# Altium schematic sheet 3_InfoPerif.SchDoc
size 414 x 293 mm; SheetNumber: 3; SheetTotal: 4
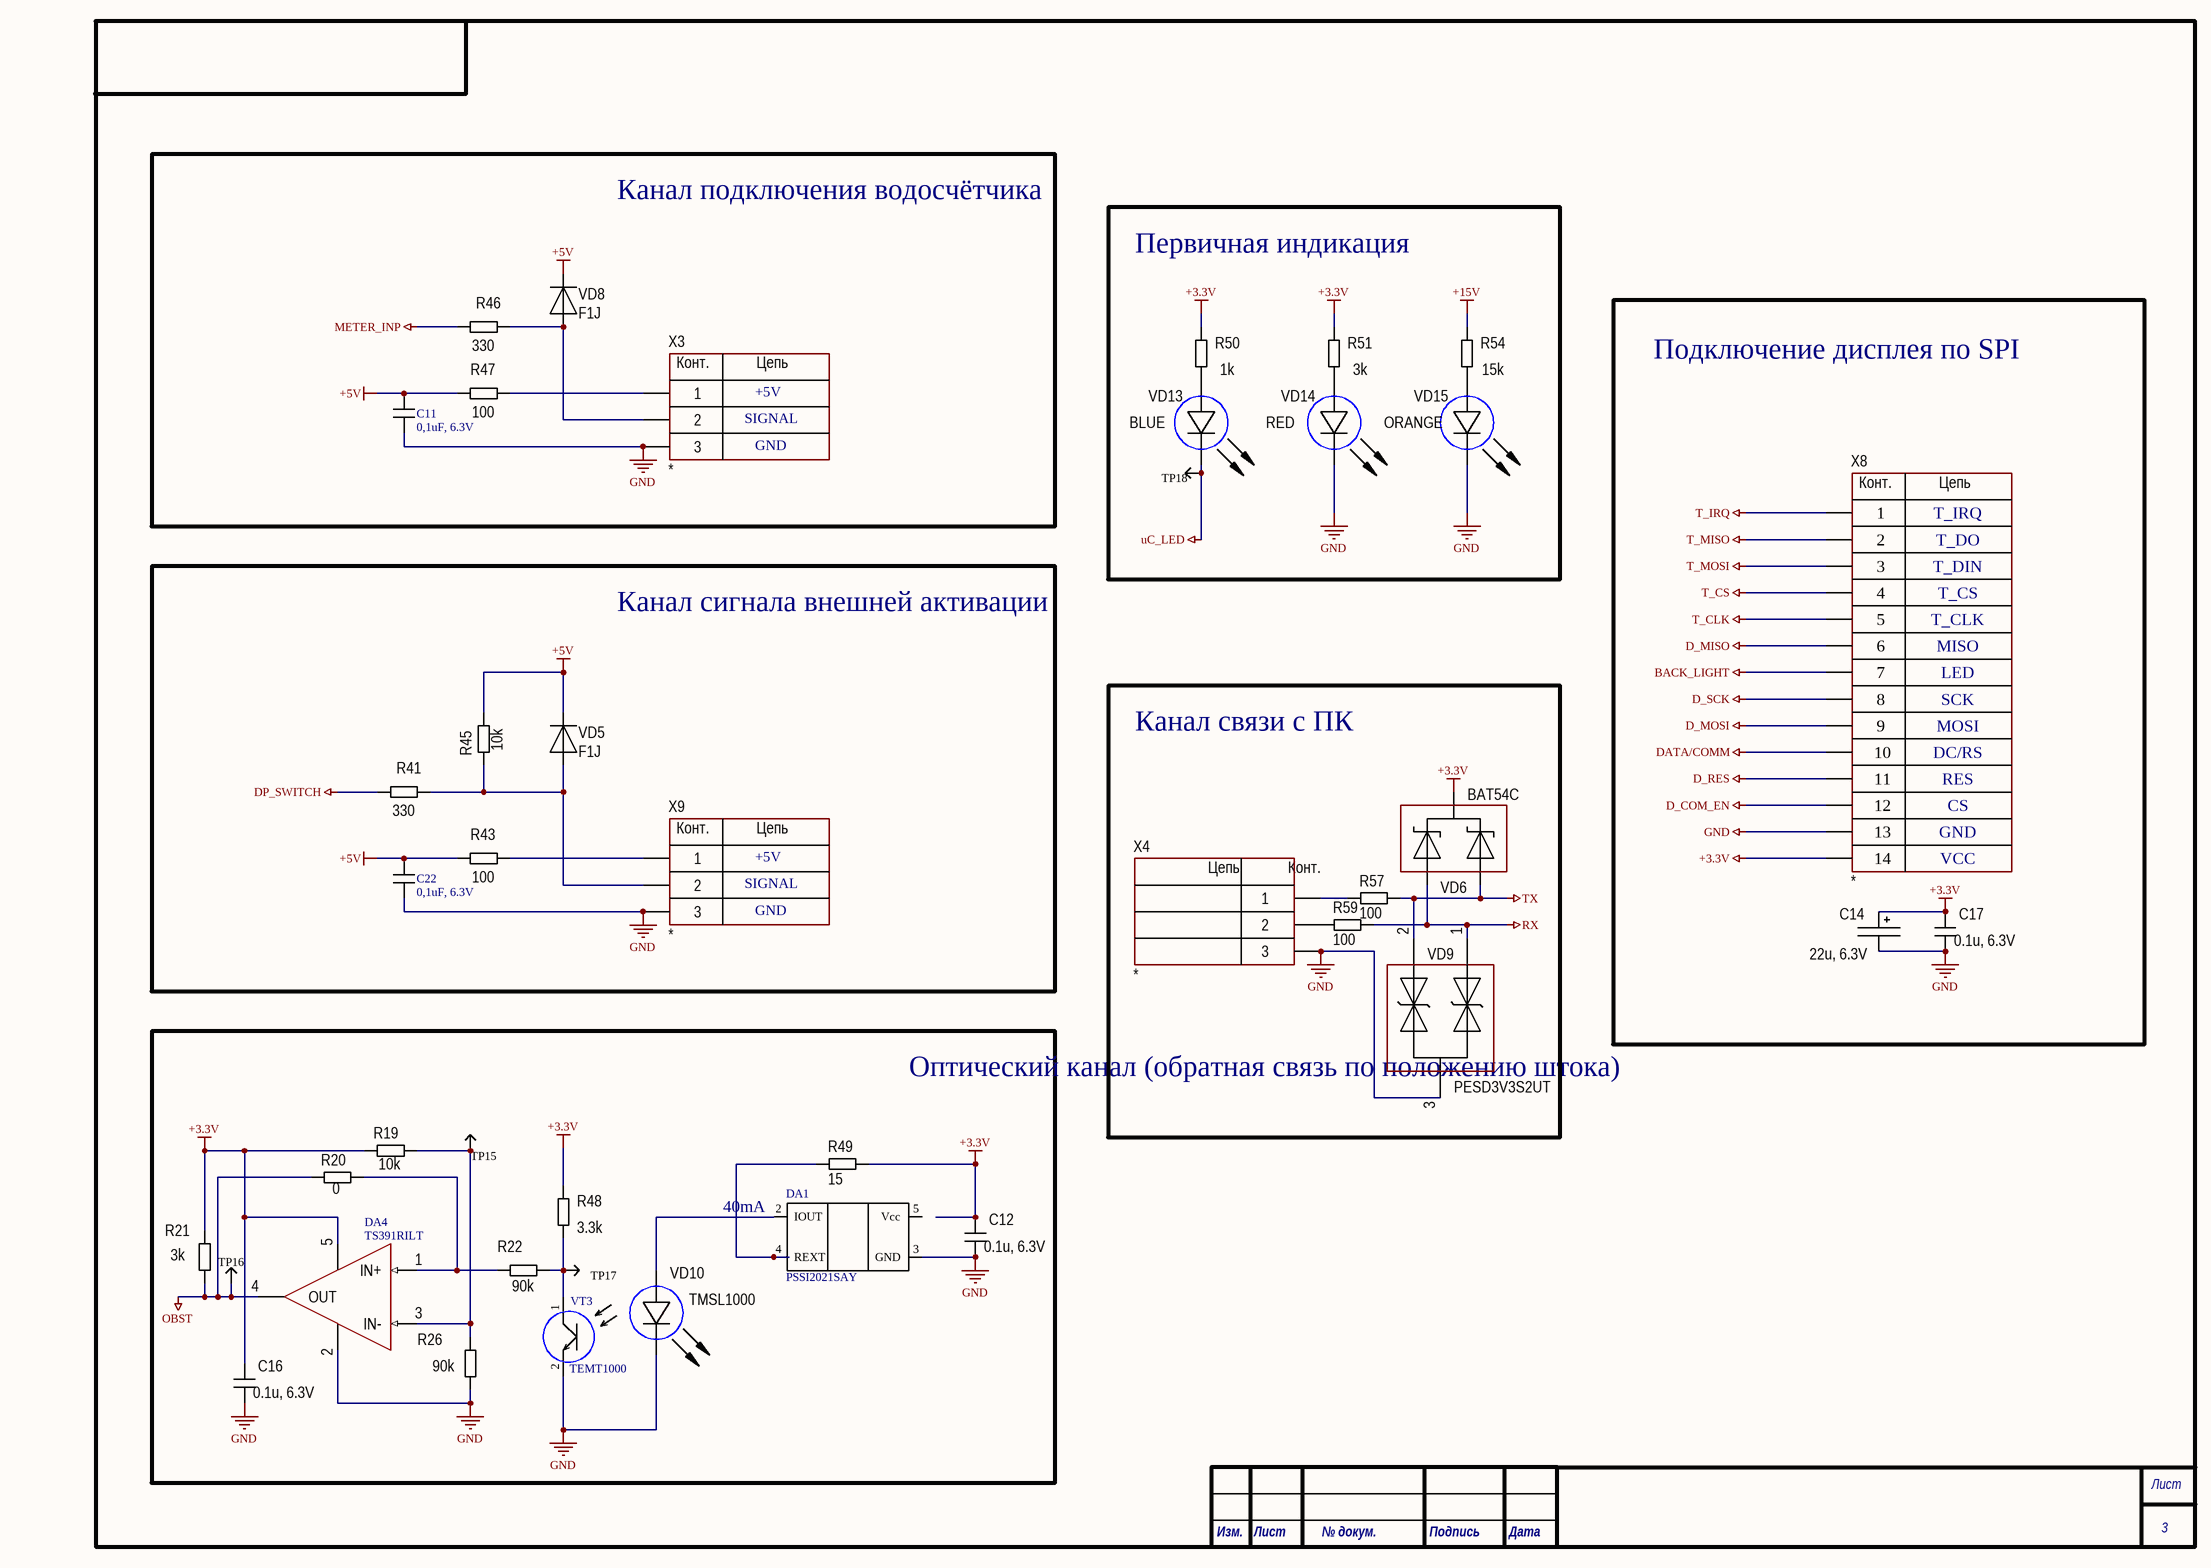
[diagram p0: 3_InfoPerif.SchDoc]

## Parts
C11  0,1uF, 6.3V  [C_0603]
C12  0.1u, 6.3V  [CH0402C]
C14  22u, 6.3V  [TANTAL_A]
C16  0.1u, 6.3V  [CH0402C]
C17  0.1u, 6.3V  [CH0402C]
C22  0,1uF, 6.3V  [C_0603]
DA1  PSSI2021SAY  [SOT353]
DA4  TS391RILT  [SOT23-5]
R19  10k  [CH0402R]
R20  0  [CH0402R]
R21  3k  [CH0402R]
R22  90k  [CH0402R]
R26  90k  [CH0402R]
R41  330  [CH0402R]
R43  100  [CH0805R]
R45  10k  [CH0603R]
R46  330  [CH0402R]
R47  100  [CH0805R]
R48  3.3k  [CH0402R]
R49  15  [CH0805R]
R50  1k  [CH0805R]
R51  3k  [CH0805R]
R54  15k  [CH0805R]
R57  100  [CH0402R]
R59  100  [CH0402R]
TP15  (no value)  [TestPoint]
TP16  (no value)  [TestPoint]
TP17  (no value)  [TestPoint]
TP18  (no value)  [TestPoint]
VD5  F1J  [SOD123F]
VD6  BAT54C  [SOT23_123]
VD8  F1J  [SOD123F]
VD9  PESD3V3S2UT  [SOT23_132]
VD10  TMSL1000  [TSML1000]
VD13  BLUE  [CH0603LB]
VD14  RED  [CH0603LB]
VD15  ORANGE  [CH0603LB]
VT3  TEMT1000  [TEMT1000]
X3  *  [CON: MX-22-05-3031]
X4  *  [CON: MX-22-05-3031]
X8  *  [DS1024-14]
X9  *  [CON: MX-22-05-3031]

## Blocks framed on the sheet
Канал подключения водосчётчика: C11 R46 R47 VD8 X3
Первичная индикация: R50 R51 R54 TP18 VD13-VD15
Подключение дисплея по SPI: C14 C17 X8
Канал сигнала внешней активации: C22 R41 R43 R45 VD5 X9
Канал связи с ПК: R57 R59 VD6 VD9 X4
Оптический канал (обратная связь по положению штока): C12 C16 DA1 DA4 R19-R22 R26 R48 R49 TP15-TP17 VD10 VT3

## Nets
+3.3V: C12.2 C14.1 C16.2 C17.2 DA4.5(V+) R19.2 R21.2 R48.2 R49.2 R50.2 R51.2 VD6.2 X8.14
+5V: C11.2 C22.2 R43.1 R45.1 R47.1 VD5.2 VD8.2
+15V: R54.2
BACK_LIGHT: X8.7
D_COM_EN: X8.12
D_MISO: X8.6
D_MOSI: X8.9
D_RES: X8.11
D_SCK: X8.8
DATA/COMM: X8.10
DP_SWITCH: R41.1
GND: C11.1 C12.1 C14.2 C16.1 C17.1 C22.1 DA1.3(GND) DA4.2(V-) R26.1 VD9.3 VD10.2(C) VD14.2(C) VD15.2(C) VT3.2 X3.3 X4.3 X8.13 X9.3
METER_INP: R46.1
OBST: DA4.4(OUT) R20.2 R21.1 TP16.0
RX: R59.2 VD6.3 VD9.1
T_CLK: X8.5
T_CS: X8.4
T_IRQ: X8.1
T_MISO: X8.2
T_MOSI: X8.3
TX: R57.2 VD6.1 VD9.2
uC_LED: TP18.0 VD13.2(C)
NetDA1_2: DA1.2(IOUT) VD10.1(A)
NetDA1_4: DA1.4(REXT) R49.1
NetDA4_1: DA4.1(IN+) R20.1 R22.2
NetDA4_3: DA4.3(IN-) R19.1 R26.2 TP15.0
NetR22_1: R22.1 R48.1 TP17.0 VT3.1
NetR41_2: R41.2 R45.2 VD5.1 X9.2
NetR43_2: R43.2 X9.1
NetR46_2: R46.2 VD8.1 X3.2
NetR47_2: R47.2 X3.1
NetR50_1: R50.1 VD13.1(A)
NetR51_1: R51.1 VD14.1(A)
NetR54_1: R54.1 VD15.1(A)
NetR57_1: R57.1 X4.1
NetR59_1: R59.1 X4.2

Not connected (* = marked no-connect by the designer): DA1 5(Vcc)

## Notes on the sheet
- SIGNAL
- +5V
- GND
- T_IRQ
- T_DO
- T_DIN
- T_CS
- T_CLK
- MISO
- LED
- SCK
- MOSI
- DC/RS
- RES
- CS
- VCC
- 40mA
- Лист
- Изм.
- № докум.
- Подпись
- Дата
- (in symbol 3-Connector) Цепь; Конт.
- (in symbol 14-Connector) Конт.; Цепь

## Library data of the parts
C11 C22 = C_SMD
C12 C16 = Capacitor: 0805; Manufacturer: *; Model: *; HelpURL: *; ComponentKind: *; Value: *
C14 = TantalCap: Manufacturer: *; Model: *; HelpURL: *; ComponentKind: *; Value: *
C17 = Capacitor: Manufacturer: *; Model: *; HelpURL: *; ComponentKind: *; Value: *
DA1 = PSSI2021SAY: Iout = 0.617/Rext + 15 µA
DA4 = LMV331M5: SOT23-5
R19-R22 R26 R41 R43 R45-R47 R50 R51 R54 R57 R59 = Resistor: Manufacturer: *; Model: *; HelpURL: *; ComponentKind: *; Value: *
R48 R49 = Resistor: 0805; Manufacturer: *; Model: *; HelpURL: *; ComponentKind: *; Value: *
TP15-TP18 = TestPoint
VD5 VD8 = Diod: ComponentKind: *; Manufacturer: *; Model: *; HelpURL: *
VD6 = Diod Schottky Array v.1: ComponentKind: *; Manufacturer: *; Model: *; HelpURL: *
VD9 = TVS Array: ComponentKind: *; Manufacturer: *; Model: *; HelpURL: *
VD10 VD13-VD15 = LED_1: Manufacturer: *; Model: *; HelpURL: *; ComponentKind: *; Value: *
X3 X4 X9 = 3-Connector: Model: *; Manufacturer: *; HelpURL: *; ComponentKind: *
X8 = 14-Connector: Model: *; Manufacturer: *; HelpURL: *; ComponentKind: *